# Altium schematic sheet HBridge.SchDoc
size Letter
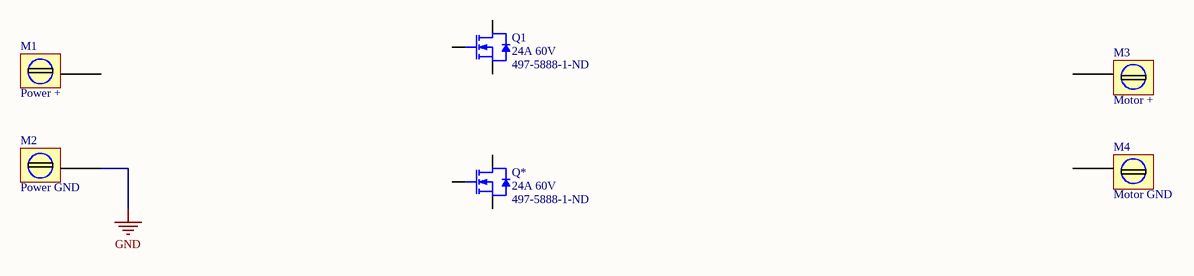
[diagram p0: HBridge.SchDoc]

## Parts
M1  Power +
M2  Power GND
M3  Motor +
M4  Motor GND
Q1  24A 60V  Supplier Part Number 1: 497-5888-1-ND  [STD20NF06LT4]
Q*  24A 60V  Supplier Part Number 1: 497-5888-1-ND  [STD20NF06LT4]

## Nets
GND: M2.1

Not connected (* = marked no-connect by the designer): M1 1; M3 1; M4 1; Q1 1(Gate) 2(Drain) 3(Source); Q* 1(Gate) 2(Drain) 3(Source)

## Library data of the parts
M1-M4 = MOTOR TERMINAL: PCB Terminal; Manufacturer: Keystone Electronics; Manufacturer Part Number: 8197; Supplier 1: Digi-Key; RoHS: Yes; Category: Terminal Blocks; Stock 1: 5361; Pricing 1: 1=0.55000, 25=0.49480, 100=0.48420, 250=0.45572, 500=0.40820 (USD); Terminal and Terminal Block Type: PCB TERMINAL; ComponentLink1URL: https://datasheet.ciiva.com:443/pdfs/VipMasterIC/IC/KEYC/KEYCS02888/KEYCS02430-1.pdf?src-supplier=IHS+Markit; ComponentLink1Description: https://datasheet.ciiva.com:443/pdfs/VipMasterIC/IC/KEYC/KEYCS02888/KEYCS02430-1.pdf?src-supplier=IHS+Markit; ComponentLink2URL: https://datasheet.ciiva.com/7628/1718301-7628724.pdf?src-supplier=Element14; ComponentLink2Description: https://datasheet.ciiva.com/7628/1718301-7628724.pdf?src-supplier=Element14; ComponentLink3URL: https://datasheet.ciiva.com/13540/8197-290639-13540277.pdf?src-supplier=Mouser; ComponentLink3Description: https://datasheet.ciiva.com/13540/8197-290639-13540277.pdf?src-supplier=Mouser; ComponentLink4URL: https://datasheet.ciiva.com/11723/0900766b800b73c3-11723309.pdf?src-supplier=RSComponents; ComponentLink4Description: https://datasheet.ciiva.com/11723/0900766b800b73c3-11723309.pdf?src-supplier=RSComponents; ComponentLink5URL: https://datasheet.ciiva.com/15174/getdatasheetpartid-410564-15174450.pdf?src-supplier=Verical; ComponentLink5Description: https://datasheet.ciiva.com/15174/getdatasheetpartid-410564-15174450.pdf?src-supplier=Verical; ComponentLink6URL: https://datasheet.ciiva.com/16405/m60-2p63-16405254.pdf?src-supplier=Future+Electronics; ComponentLink6Description: https://datasheet.ciiva.com/16405/m60-2p63-16405254.pdf?src-supplier=Future+Electronics; Supplier Part Number 1: 36-8197-ND
Q1 Q* = MOSFET: Power Field-Effect Transistor, 24A I(D), 60V, 0.05ohm, 1-Element, N-Channel, Silicon, Metal-oxide Semiconductor FET, TO-252AA; Manufacturer: STMicroelectronics; Package Body Material: Plastic; Avalanche Energy Rating (Eas): 225mJ; Drain-source On Resistance-Max: 50mR; Number of Elements: 1; Operating Mode: ENHANCEMENT MODE; Power Dissipation-Max (Abs): 60W; Pulsed Drain Current-Max (IDM): 96A; Time @ Peak Reflow Temperature-Max (s): 30s; Transistor Application: SWITCHING; Qualification Status: Not Qualified; Supplier 1: Digi-Key; Manufacturer Part Number: STD20NF06LT4; RoHS: Yes; Category: MOSFETs; Stock 1: 17979; Pricing 1: 1=0.99000, 10=0.81000, 25=0.79520, 100=0.63000, 500=0.53400, 1000=0.43500 (USD); Number of Pins: 2; Package Shape: Rectangular; Terminal Finish: Tin; Transistor Element Material: SILICON; Max Operating Temperature: 175°C; JESD-609 Code: e3; Polarity/Channel Type: N-CHANNEL; Drain Current-Max (Abs) (ID): 24A; Drain Current-Max (ID): 24A; DS Breakdown Voltage-Min: 60V; FET Technology: METAL-OXIDE SEMICONDUCTOR; JESD-30 Code: R-PSSO-G2; Moisture Sensitivity Level: 1; Package Style: SMALL OUTLINEMeter; Peak Reflow Temperature (Cel): 260°C; Surface Mount: Yes; Terminal Form: Gull Wing; Terminal Position: SINGLE; JEDEC-95 Code: TO-252AA; ComponentLink1URL: https://datasheet.ciiva.com:443/pdfs/VipMasterIC/IC/SGST/SGSTS16849/SGSTS16849-1.pdf?src-supplier=IHS+Markit; ComponentLink1Description: https://datasheet.ciiva.com:443/pdfs/VipMasterIC/IC/SGST/SGSTS16849/SGSTS16849-1.pdf?src-supplier=IHS+Markit; ComponentLink2URL: https://datasheet.ciiva.com/5774/129580-5774199.pdf?src-supplier=Farnell; ComponentLink2Description: https://datasheet.ciiva.com/5774/129580-5774199.pdf?src-supplier=Farnell; ComponentLink3URL: https://datasheet.ciiva.com/4442/cd00003407-43085-4442056.pdf?src-supplier=Mouser; ComponentLink3Description: https://datasheet.ciiva.com/4442/cd00003407-43085-4442056.pdf?src-supplier=Mouser; ComponentLink4URL: https://datasheet.ciiva.com/25625/0900766b810e88d3-25625611.pdf?src-supplier=RSComponents; ComponentLink4Description: https://datasheet.ciiva.com/25625/0900766b810e88d3-25625611.pdf?src-supplier=RSComponents; ComponentLink5URL: https://datasheet.ciiva.com/46451/1398479-46451621.pdf?src-supplier=Jameco; ComponentLink5Description: https://datasheet.ciiva.com/46451/1398479-46451621.pdf?src-supplier=Jameco; ComponentLink6URL: https://datasheet.ciiva.com/16220/cd00003407-16220218.pdf?src-supplier=Future+Electronics; ComponentLink6Description: https://datasheet.ciiva.com/16220/cd00003407-16220218.pdf?src-supplier=Future+Electronics; ComponentLink7URL: https://datasheet.ciiva.com/17320/cd00003407-17320843.pdf?src-supplier=Avnet+Europe; ComponentLink7Description: https://datasheet.ciiva.com/17320/cd00003407-17320843.pdf?src-supplier=Avnet+Europe; ComponentLink8URL: https://datasheet.ciiva.com/937/cd00003407-937437.pdf?src-supplier=Digi-Key; ComponentLink8Description: https://datasheet.ciiva.com/937/cd00003407-937437.pdf?src-supplier=Digi-Key; ComponentLink9URL: https://datasheet.ciiva.com/937/cd00003407-937438.pdf?src-supplier=Digi-Key; ComponentLink9Description: https://datasheet.ciiva.com/937/cd00003407-937438.pdf?src-supplier=Digi-Key; ComponentLink10URL: https://datasheet.ciiva.com/937/cd00003407-937439.pdf?src-supplier=Digi-Key; ComponentLink10Description: https://datasheet.ciiva.com/937/cd00003407-937439.pdf?src-supplier=Digi-Key